# Altium schematic sheet gydrodrive_can.SchDoc
size 297 x 209 mm; SheetNumber: 16; SheetTotal: 22
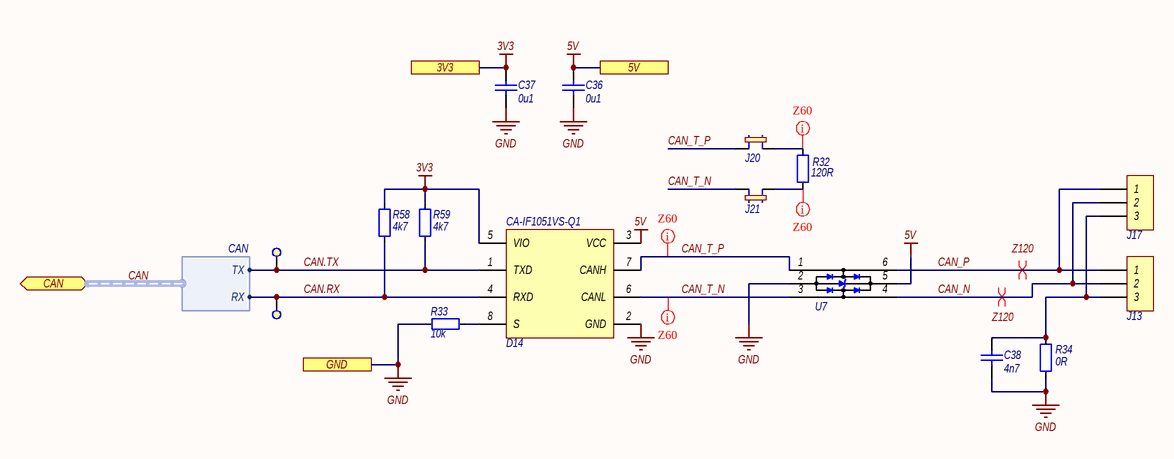
[diagram p0: gydrodrive_can.SchDoc]

## Parts
C36  Capacitance: 0u1  [CAPC2012-0805M]  (hidden comment: CAP_0805)
C37  Capacitance: 0u1  [CAPC2012-0805M]  (hidden comment: CAP_0805)
C38  Capacitance: 4n7  [CAPC3216-1206M]  (hidden comment: CAP_1206)
D14  CA-IF1051VS-Q1  [SO8_N]
J13  DG142V-5.08-03P  [DG142V-5.08-03P]  (value not drawn)
J17  DG142V-5.08-03P  [DG142V-5.08-03P]  (value not drawn)
J20  PLS-2.54-2 JUMP  [PLS-2-2.54]  (value not drawn)
J21  PLS-2.54-2 JUMP  [PLS-2-2.54]  (value not drawn)
R32  Resistance: 120R  [RESC3216-1206M]  (hidden comment: RES_1206)
R33  Resistance: 10k  [RESC2012-0805M]  (hidden comment: RES_0805)
R34  Resistance: 0R  [RESC3216-1206M]  (hidden comment: RES_1206)
R58  Resistance: 4k7  [RESC2012-0805M]  (hidden comment: RES_0805)
R59  Resistance: 4k7  [RESC2012-0805M]  (hidden comment: RES_0805)
TP14  Test point 1  [TP_1]  (value not drawn)  (no BOM)
TP15  Test point 1  [TP_1]  (value not drawn)  (no BOM)
U7  USBLC6-2SC6  [SOT23-6AM]  (value not drawn)

## Ports
3V3 (see gydrodrive_interfaces[3C], gydrodrive_button[2B], gydrodrive_debugger[2B], gydrodrive_encoder[1A], gydrodrive_indication[3C], gydrodrive_inputTrim[2B], gydrodrive_interfaces[3C], gydrodrive_mcu[4C], gydrodrive_rs485[4B], gydrodrive_sto[2B], gydrodrive_supply[3C]), 5V (see gydrodrive_interfaces[3C], gydrodrive_currentSource[1C], gydrodrive_discreteControl[2B], gydrodrive_interfaces[3C], gydrodrive_supply[3B]), CAN (bidir, harness CAN, see gydrodrive_interfaces[4C], gydrodrive_mcu[1C]), GND (see gydrodrive_interfaces[3D], gydrodrive_button[2C], gydrodrive_control[2C], gydrodrive_currentSource[1B], gydrodrive_debugger[3C], gydrodrive_discreteControl[2B], gydrodrive_encoder[1B], gydrodrive_i2c[5C], gydrodrive_indication[3C], gydrodrive_inputTrim[2C], gydrodrive_interfaces[3A], gydrodrive_linearPosSensor[2C], gydrodrive_mcu[6D], gydrodrive_reservedPins[2C], gydrodrive_rs485[3B], gydrodrive_sensor[2C], gydrodrive_sensors[1B], gydrodrive_sto[2C], gydrodrive_supply[2C], gydrodrive_uart[4C])

## Harnesses
CAN: TX, RX

## Nets
3V3: C37.2 D14.5(VIO) R58.2 R59.2 ; port 3V3
5V: C36.2 D14.3(VCC) U7.5(Vbus) ; port 5V
GND: C36.1 C37.1 C38.1 D14.2(GND) R33.1 R34.2 U7.2(GND) ; port GND
CAN.RX: D14.4(RXD) R58.1 TP15.1 ; port CAN.RX
CAN.TX: D14.1(TXD) R59.1 TP14.1 ; port CAN.TX
CAN_N: J13.2 J17.2 U7.4(IO2)
CAN_P: J13.1 J17.1 U7.6(IO1)
CAN_T_N: D14.6(CANL) J21.2 U7.3(IO2)
CAN_T_P: D14.7(CANH) J20.2 U7.1(IO1)
NetC38_2: C38.2 J13.3 J17.3 R34.1
NetD14_8: D14.8(S) R33.2
NetJ20_1: J20.1 R32.2
NetJ21_1: J21.1 R32.1

## Buses and harness runs
harness CAN = port CAN

## Layout directives
differential pair; differential pair class Z120: CAN_N, CAN_P
net class Z60: CAN_T_N, CAN_T_P, NetJ20_1, NetJ21_1

## Notes on the sheet
- Подп. и дата
- Инв. № дубл.
- Взам. инв. №
- Инв. № подл.
- Изм.
- Лист
- № докум.
- Подп.
- Дата
- Копировал
- Формат
- A4

## Library data of the parts
C36 C37 = CAPC_0805: Конденсатор керамический, корпус 0805; Parameters: 0u1,  50V; Voltage: 50V; Max Price: 5; Part Number: CAPC_0805; Part Name: ='Конд-р керам. 0805,  '  + Parameters; Component Type: Standart; Pin Count: 2
C38 = CAPC_1206: Конденсатор керамический, корпус 1206; Parameters: 4n7,  50V; Voltage: 50V; Max Price: 12; Part Number: CAPC_1206; Part Name: ='Конд-р керам. 1206,  '  + Parameters; Component Type: Standart; Pin Count: 2
D14 = CA-IF1051VS-Q1: CAN интерфейс; Part Name: Микросхема CA-IF1051VS-Q1; Max Price: 50; Part Number: CA-IF1051VS-Q1; Component Type: Standart; Parameters: CAN
J13 J17 = DG142V-5.08-03P: Клеммник 3-контактный, шаг 5.08 мм; Part Name: Клеммник DG142V-5.08-03P; Parameters: 8А; Max Price: 60; System: Connector; Part Number: DG142V-5.08-03P; Component Type: Standart; Pin Count: 3
J20 J21 = PLS-2.54-2 JUMP: Разъем штыревой шаг 2.54 мм; Part Name: Разъем PLS-2, шаг 2.54 мм; Parameters: 2.54 мм; Max Price: 10; System: Connector; Part Number: PLS-2.54-2 JUMP; Component Type: Standart; Pin Count: 2
R32 = RESC_1206: Рез-р, корпус 1206; Tolerance: 5%; Parameters: 120R, 5%; Max Price: 12; Part Number: RESC_1206; Part Name: ='Рез-р 1206, ' + Parameters; Component Type: Standart
R33 = RESC_0805: Рез-р, корпус 0805; Tolerance: 5%; Parameters: 10k, 5%; Max Price: 3; Part Number: RESC_0805; Part Name: ='Рез-р 0805, ' + Parameters; Component Type: Standart
R34 = RESC_1206: Рез-р, корпус 1206; Tolerance: 5%; Parameters: 0R, 5%; Max Price: 12; Part Number: RESC_1206; Part Name: ='Рез-р 1206, ' + Parameters; Component Type: Standart
R58 R59 = RESC_0805: Рез-р, корпус 0805; Tolerance: 5%; Parameters: 4k7, 5%; Max Price: 3; Part Number: RESC_0805; Part Name: ='Рез-р 0805, ' + Parameters; Component Type: Standart
TP14 TP15 = Test point 1: Тестовый контакт круглый 1 мм; Part Number: Test point 1; Part Name: Тестовый контакт; Component Type: Standart (No BOM)
U7 = USBLC6-2SC6: Диодная сборка для защиты дифференциальной линии; Part Name: Диодная сборка USBLC6-2SC6; Parameters: 5.25V; Max Price: 30; Part Number: USBLC6-2SC6; Component Type: Standart; Pin Count: 6; Voltage: 5.25V